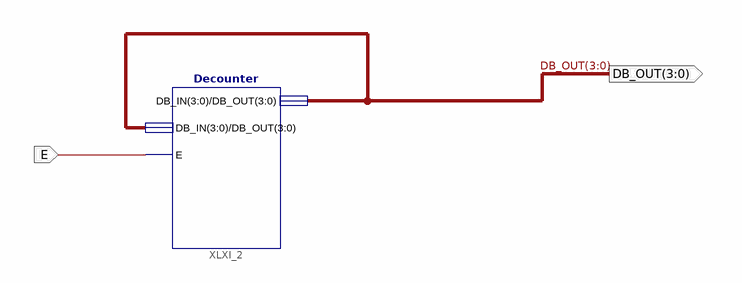
[diagram p0: schematic sheet 1]
// Xilinx ISE schematic Scheme.sch (spartan6) as structural Verilog: 1 symbols, 2 ports
module Scheme (
  input  E,
  output [3:0] DB_OUT
);

  Decounter XLXI_2 (.E(E), .DB_IN(DB_OUT), .DB_OUT(DB_OUT));
endmodule
